# Altium project DIY-USB Led Controller.PrjPcb
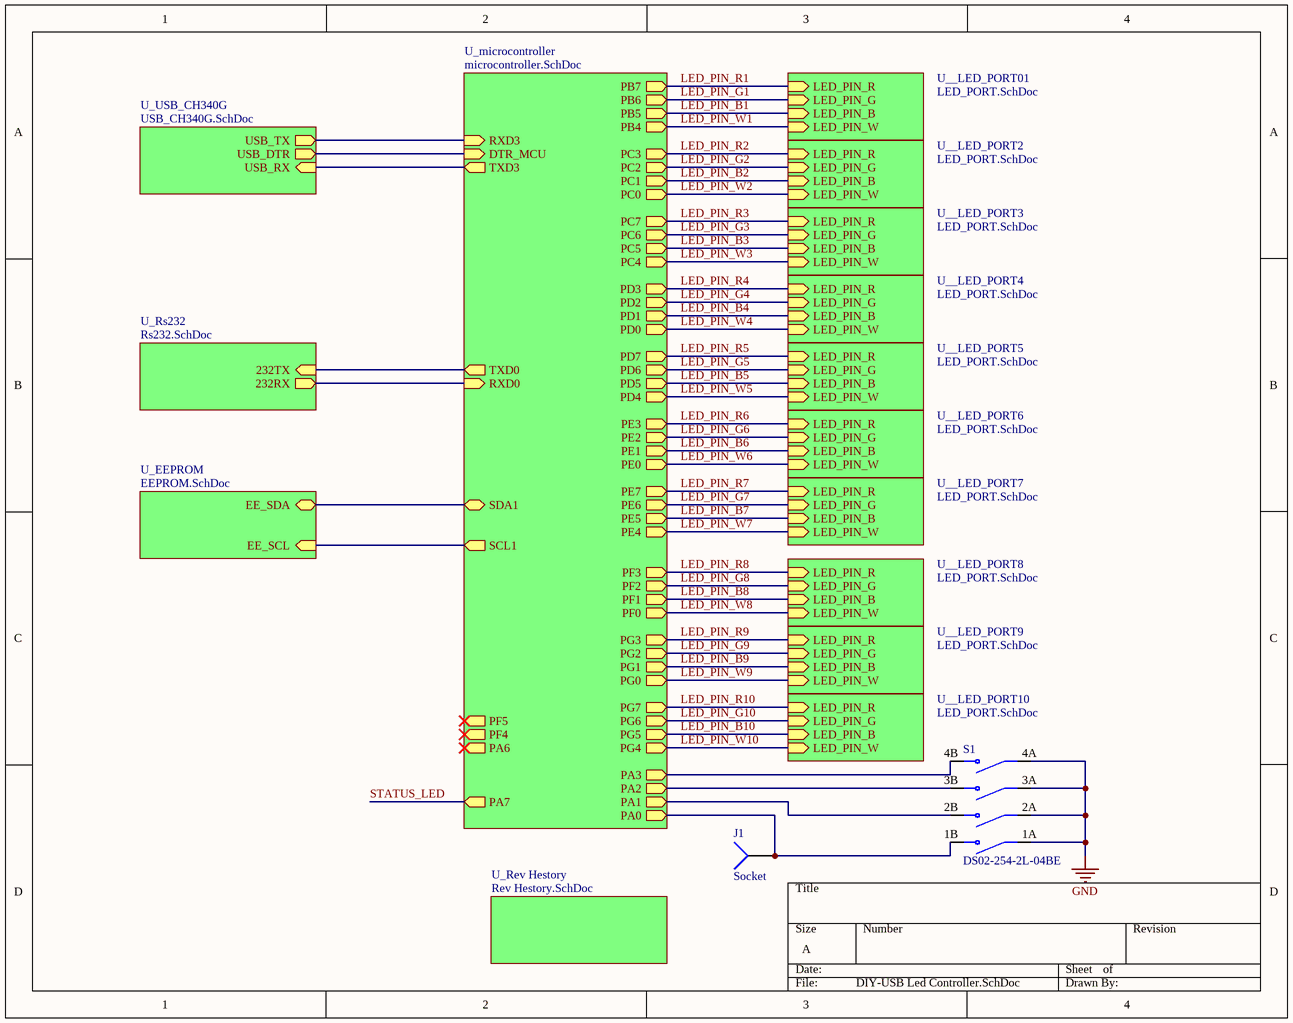
[diagram p0: DIY-USB Led Controller.SchDoc]
7 sheets, 233 parts. Net scope: hierarchical (ports join the sheet entries above them; power ports are global).
Board file: DIY-USB Led Controller.PcbDoc
Sheets:
  DIY-USB Led Controller.SchDoc
    U_EEPROM = EEPROM.SchDoc
    U_Rs232 = Rs232.SchDoc
    U_USB_CH340G = USB_CH340G.SchDoc
    U_microcontroller = microcontroller.SchDoc
    U_Rev Hestory = Rev Hestory.SchDoc
    U__LED_PORT01 = LED_PORT.SchDoc
    U__LED_PORT2 = LED_PORT.SchDoc
    U__LED_PORT3 = LED_PORT.SchDoc
    U__LED_PORT4 = LED_PORT.SchDoc
    U__LED_PORT5 = LED_PORT.SchDoc
    U__LED_PORT6 = LED_PORT.SchDoc
    U__LED_PORT7 = LED_PORT.SchDoc
    U__LED_PORT8 = LED_PORT.SchDoc
    U__LED_PORT9 = LED_PORT.SchDoc
    U__LED_PORT10 = LED_PORT.SchDoc

## Sheet DIY-USB Led Controller.SchDoc
size A; DocumentNumber: 1; SheetNumber: 1; SheetTotal: 7

### Parts
J1  Socket  [PIN1]
S1  DS02-254-2L-04BE  [SW_DS02-254-2L-04BE]

### Sub-sheets
U__LED_PORT01 = LED_PORT.SchDoc: LED_PIN_R (in), LED_PIN_B (in), LED_PIN_W (in), LED_PIN_G (in)
U__LED_PORT2 = LED_PORT.SchDoc: LED_PIN_R (in), LED_PIN_B (in), LED_PIN_W (in), LED_PIN_G (in)
U__LED_PORT3 = LED_PORT.SchDoc: LED_PIN_R (in), LED_PIN_B (in), LED_PIN_W (in), LED_PIN_G (in)
U__LED_PORT4 = LED_PORT.SchDoc: LED_PIN_R (in), LED_PIN_B (in), LED_PIN_W (in), LED_PIN_G (in)
U__LED_PORT5 = LED_PORT.SchDoc: LED_PIN_R (in), LED_PIN_B (in), LED_PIN_W (in), LED_PIN_G (in)
U__LED_PORT6 = LED_PORT.SchDoc: LED_PIN_R (in), LED_PIN_B (in), LED_PIN_W (in), LED_PIN_G (in)
U__LED_PORT7 = LED_PORT.SchDoc: LED_PIN_R (in), LED_PIN_B (in), LED_PIN_W (in), LED_PIN_G (in)
U__LED_PORT8 = LED_PORT.SchDoc: LED_PIN_R (in), LED_PIN_B (in), LED_PIN_W (in), LED_PIN_G (in)
U__LED_PORT9 = LED_PORT.SchDoc: LED_PIN_R (in), LED_PIN_B (in), LED_PIN_W (in), LED_PIN_G (in)
U__LED_PORT10 = LED_PORT.SchDoc: LED_PIN_R (in), LED_PIN_B (in), LED_PIN_W (in), LED_PIN_G (in)
U_EEPROM = EEPROM.SchDoc: EE_SCL (in), EE_SDA (bidir)
U_microcontroller = microcontroller.SchDoc: PC0 (out), PC1 (out), PC2 (out), PC3 (out), PC4 (out), PC5 (out), PC6 (out), PC7 (out), PE0 (out), PE1 (out), PE2 (out), PE3 (out), PE4 (out), PE5 (out), PE6 (out), PE7 (out), PG0 (out), PG1 (out), PG2 (out), PG3 (out), PG4 (out), PG5 (out), PG6 (out), PG7 (out), PB7 (out), PB6 (out), PB5 (out), PB4 (out), SCL1 (out), SDA1 (bidir), RXD3 (in), TXD3 (out), PD7 (out), PD6 (out), PD5 (out), PD4 (out), PD3 (out), PD2 (out), PD1 (out), PD0 (out), TXD0 (out), RXD0 (in), DTR_MCU (in), PF5 (out), PF4 (out), PF3 (out), PF2 (out), PF1 (out), PF0 (out), PA1 (out), PA3 (out), PA2 (out), PA0 (out), PA7 (out), PA6 (out)
U_Rev Hestory = Rev Hestory.SchDoc: no entries
U_Rs232 = Rs232.SchDoc: 232TX (in), 232RX (out)
U_USB_CH340G = USB_CH340G.SchDoc: USB_TX (out), USB_RX (in), USB_DTR (out)

### Nets
GND: S1.1A(COM1) S1.2A(COM2) S1.3A(COM3) S1.4A(COM4)
232RX: sheet U_Rs232/232RX, sheet U_microcontroller/RXD0
232TX: sheet U_Rs232/232TX, sheet U_microcontroller/TXD0
DTR: sheet U_USB_CH340G/USB_DTR, sheet U_microcontroller/DTR_MCU
EE_SCL: sheet U_EEPROM/EE_SCL, sheet U_microcontroller/SCL1
EE_SDA: sheet U_EEPROM/EE_SDA, sheet U_microcontroller/SDA1
LED_PIN_B1: sheet U_microcontroller/PB5, sheet U__LED_PORT01/LED_PIN_B
LED_PIN_B2: sheet U_microcontroller/PC1, sheet U__LED_PORT2/LED_PIN_B
LED_PIN_B3: sheet U_microcontroller/PC5, sheet U__LED_PORT3/LED_PIN_B
LED_PIN_B4: sheet U_microcontroller/PD1, sheet U__LED_PORT4/LED_PIN_B
LED_PIN_B5: sheet U_microcontroller/PD5, sheet U__LED_PORT5/LED_PIN_B
LED_PIN_B6: sheet U_microcontroller/PE1, sheet U__LED_PORT6/LED_PIN_B
LED_PIN_B7: sheet U_microcontroller/PE5, sheet U__LED_PORT7/LED_PIN_B
LED_PIN_B8: sheet U_microcontroller/PF1, sheet U__LED_PORT8/LED_PIN_B
LED_PIN_B9: sheet U_microcontroller/PG1, sheet U__LED_PORT9/LED_PIN_B
LED_PIN_B10: sheet U_microcontroller/PG5, sheet U__LED_PORT10/LED_PIN_B
LED_PIN_G1: sheet U_microcontroller/PB6, sheet U__LED_PORT01/LED_PIN_G
LED_PIN_G2: sheet U_microcontroller/PC2, sheet U__LED_PORT2/LED_PIN_G
LED_PIN_G3: sheet U_microcontroller/PC6, sheet U__LED_PORT3/LED_PIN_G
LED_PIN_G4: sheet U_microcontroller/PD2, sheet U__LED_PORT4/LED_PIN_G
LED_PIN_G5: sheet U_microcontroller/PD6, sheet U__LED_PORT5/LED_PIN_G
LED_PIN_G6: sheet U_microcontroller/PE2, sheet U__LED_PORT6/LED_PIN_G
LED_PIN_G7: sheet U_microcontroller/PE6, sheet U__LED_PORT7/LED_PIN_G
LED_PIN_G8: sheet U_microcontroller/PF2, sheet U__LED_PORT8/LED_PIN_G
LED_PIN_G9: sheet U_microcontroller/PG2, sheet U__LED_PORT9/LED_PIN_G
LED_PIN_G10: sheet U_microcontroller/PG6, sheet U__LED_PORT10/LED_PIN_G
LED_PIN_R1: sheet U_microcontroller/PB7, sheet U__LED_PORT01/LED_PIN_R
LED_PIN_R2: sheet U_microcontroller/PC3, sheet U__LED_PORT2/LED_PIN_R
LED_PIN_R3: sheet U_microcontroller/PC7, sheet U__LED_PORT3/LED_PIN_R
LED_PIN_R4: sheet U_microcontroller/PD3, sheet U__LED_PORT4/LED_PIN_R
LED_PIN_R5: sheet U_microcontroller/PD7, sheet U__LED_PORT5/LED_PIN_R
LED_PIN_R6: sheet U_microcontroller/PE3, sheet U__LED_PORT6/LED_PIN_R
LED_PIN_R7: sheet U_microcontroller/PE7, sheet U__LED_PORT7/LED_PIN_R
LED_PIN_R8: sheet U_microcontroller/PF3, sheet U__LED_PORT8/LED_PIN_R
LED_PIN_R9: sheet U_microcontroller/PG3, sheet U__LED_PORT9/LED_PIN_R
LED_PIN_R10: sheet U_microcontroller/PG7, sheet U__LED_PORT10/LED_PIN_R
LED_PIN_W1: sheet U_microcontroller/PB4, sheet U__LED_PORT01/LED_PIN_W
LED_PIN_W2: sheet U_microcontroller/PC0, sheet U__LED_PORT2/LED_PIN_W
LED_PIN_W3: sheet U_microcontroller/PC4, sheet U__LED_PORT3/LED_PIN_W
LED_PIN_W4: sheet U_microcontroller/PD0, sheet U__LED_PORT4/LED_PIN_W
LED_PIN_W5: sheet U_microcontroller/PD4, sheet U__LED_PORT5/LED_PIN_W
LED_PIN_W6: sheet U_microcontroller/PE0, sheet U__LED_PORT6/LED_PIN_W
LED_PIN_W7: sheet U_microcontroller/PE4, sheet U__LED_PORT7/LED_PIN_W
LED_PIN_W8: sheet U_microcontroller/PF0, sheet U__LED_PORT8/LED_PIN_W
LED_PIN_W9: sheet U_microcontroller/PG0, sheet U__LED_PORT9/LED_PIN_W
LED_PIN_W10: sheet U_microcontroller/PG4, sheet U__LED_PORT10/LED_PIN_W
RXD: sheet U_USB_CH340G/USB_RX, sheet U_microcontroller/TXD3
RXD3: sheet U_USB_CH340G/USB_TX, sheet U_microcontroller/RXD3
NetJ1_1: J1.1 S1.1B(NO1) ; sheet U_microcontroller/PA0
NetS1_2B: S1.2B(NO2) ; sheet U_microcontroller/PA1
NetS1_3B: S1.3B(NO3) ; sheet U_microcontroller/PA2
NetS1_4B: S1.4B(NO4) ; sheet U_microcontroller/PA3

### Library data of the parts
S1 = DS02-254-2L-04BE: Dip Switch SPST 4 Position Through Hole, Right Angle Piano Actuator 25mA 24VDC; Package: None; Price: None; Value: *; MP: DS02-254-2L-04BE; Availability: Unavailable
J1 = Socket: LatestRevisionDate: 17-Jul-2002; LatestRevisionNote: Re-released for DXP Platform.; Publisher: Altium Limited

## Sheet EEPROM.SchDoc
size A; DocumentNumber: 4; SheetNumber: 4; SheetTotal: 7
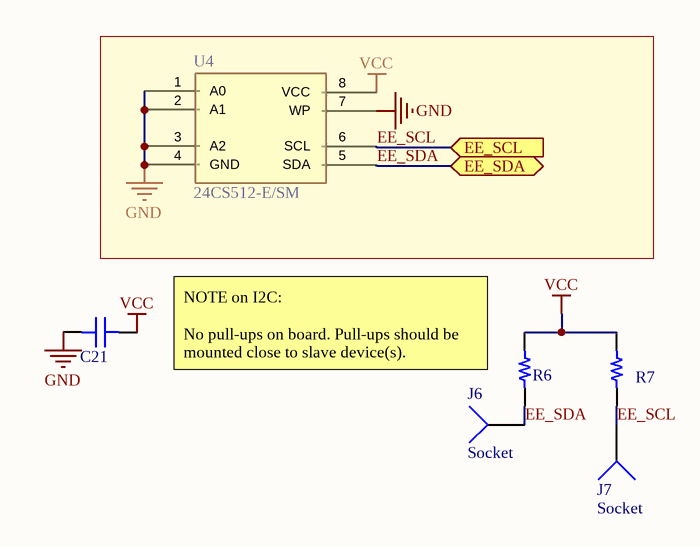
[diagram p1: EEPROM.SchDoc]

### Parts
C21  C0805C104M5RAC7025  [CAP SMD 0805]  (value not drawn)
J6  Socket  [PIN1]
J7  Socket  [PIN1]
R6  10K  [RES SMD 0805]  (value not drawn)
R7  10K  [RES SMD 0805]  (value not drawn)
U4  24CS512-E/SM  [21-0041B_8]

### Ports
EE_SCL (in), EE_SDA (bidir)

### Nets
GND: C21.1 U4.1(A0) U4.2(A1) U4.3(A2) U4.4(GND) U4.7(WP)
VCC: C21.2 R6.2 R7.2 U4.8(VCC)
EE_SCL: J7.1 R7.1 U4.6(SCL) ; port EE_SCL
EE_SDA: J6.1 R6.1 U4.5(SDA) ; port EE_SDA

### Notes on the sheet
- NOTE on I2C:
  No pull-ups on board. Pull-ups should be mounted close to slave device(s).

### Library data of the parts
C21 = CAPACITOR X7R: 0.1 µF ±20% 50V Ceramic Capacitor X7R 0805 (2012 Metric)
R6 R7 = RESISTOR: RES SMD 10K OHM 1% 1/4W 0805
U4 = AT24CW16X/24CW32X/24CW64X: EEPROM Memory IC 512Kb (64K x 8) I²C 3.4 MHz 400 ns 8-SOIJ
J6 J7 = Socket: LatestRevisionDate: 17-Jul-2002; LatestRevisionNote: Re-released for DXP Platform.; Publisher: Altium Limited

## Sheet Rs232.SchDoc
size A4; Organization: Altium Limited; Address1: L3, 12a Rodborough Rd; Address2: Frenchs Forest; Address3: NSW; Address4: Australia 2086; DocumentNumber: 2; SheetNumber: 2; SheetTotal: 7
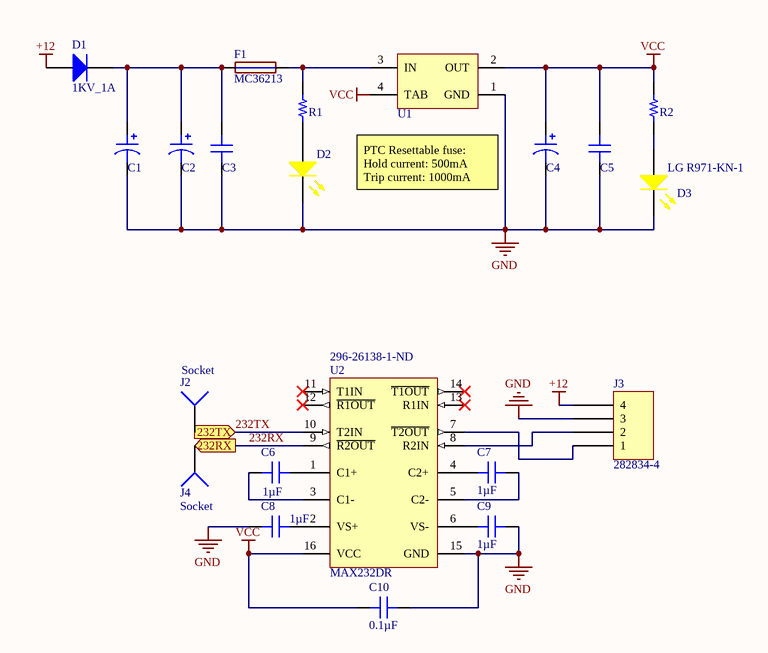
[diagram p2: Rs232.SchDoc]

### Parts
C1  UVY1C471MPD  [Cap 6.3x11 THT]  (value not drawn)
C2  UVY1C471MPD  [Cap 6.3x11 THT]  (value not drawn)
C3  C0805C475K9PAC7210  [CAP SMD 0805]  (value not drawn)
C4  UVY1C471MPD  [Cap 6.3x11 THT]  (value not drawn)
C5  C0805C475K9PAC7210  [CAP SMD 0805]  (value not drawn)
C6  value 1µF  [CAP SMD 0805]  (hidden comment: C0805C105K5RACAUTO)
C7  value 1µF  [CAP SMD 0805]  (hidden comment: C0805C105K5RACAUTO)
C8  value 1µF  [CAP SMD 0805]  (hidden comment: C0805C105K5RACAUTO)
C9  value 1µF  [CAP SMD 0805]  (hidden comment: C0805C105K5RACAUTO)
C10  value 0.1µF  [CAP SMD 0805]  (hidden comment: C0805C104M5RAC7025)
D1  1KV_1A  [Diod DO-214AC]
D2  LS R976-NR-1  [LED 0805]  (value not drawn)
D3  LG R971-KN-1  [LED 0805]
F1  value MC36213  [AP2-00002]  (hidden comment: Farnell no: 1861197)
J2  Socket  [PIN1]
J3  282834-4  [CONN. 4]
J4  Socket  [PIN1]
R1  10K  [RES SMD 0805]  (value not drawn)
R2  1K  [RES SMD 0805]  (value not drawn)
U1  LM1117IMP-5.0/NOPB  [ON SEMI SOT-223 ST(318H)]  (value not drawn)
U2  MAX232DR  Supplier Part Number 1: 296-26138-1-ND  [SOIC 16]

### Ports
232RX (out), 232TX (in)

### Nets
+12: D1.2(ANODE) J3.4
GND: C1.2 C2.2 C3.1 C4.2 C5.1 C8.1 C9.2 C10.2 D2.1(Cathode) D3.1(Cathode) J3.3 U1.1(GND) U2.15(GND)
VCC: C4.1 C5.2 C10.1 R2.2 U1.2(OUT) U1.4(TAB) U2.16(VCC)
232RX: J4.1 U2.9(~{R2OUT}) ; port 232RX
232TX: J2.1 U2.10(T2IN) ; port 232TX
NetC1_1: C1.1 C2.1 C3.2 D1.1(CATHODE) F1.1
NetC6_1: C6.1 U2.3(C1-)
NetC6_2: C6.2 U2.1(C1+)
NetC7_1: C7.1 U2.4(C2+)
NetC7_2: C7.2 U2.5(C2-)
NetC8_2: C8.2 U2.2(VS+)
NetC9_1: C9.1 U2.6(VS-)
NetD2_2: D2.2(Anode) R1.1
NetD3_2: D3.2(Anode) R2.1
NetF1_2: F1.2 R1.2 U1.3(IN)
NetJ3_1: J3.1 U2.7(~{T2OUT})
NetJ3_2: J3.2 U2.8(R2IN)

Not connected (* = marked no-connect by the designer): U2 11(T1IN)* 12(~{R1OUT})* 13(R1IN)* 14(~{T1OUT})*

### Notes on the sheet
- PTC Resettable fuse:
  Hold current: 500mA
  Trip current: 1000mA
- Title
- Size:
- Date:
- A4
- Number:
- Time:
- Revision:
- Sheet
- of
- File:

### Library data of the parts
C1 C2 C4 = POLARIZED CAP: CAP ALUM 470UF 20% 16V RADIAL
C3 C5 = CAPACITOR X7R: 4.7 µF ±10% 6.3V Ceramic Capacitor X5R 0805 (2012 Metric)
C6-C9 = 12065C105JAT2A: 1 µF ±10% 50V Ceramic Capacitor X7R 0805 (2012 Metric); Manufacturer: AVX Corporation; Tolerance: ±5%; Part Number: 12065C105JAT2A; Applications: General Purpose; Capacitance: 1µF; ComponentLink1Description: Datasheet; ComponentLink1URL: http://datasheets.avx.com/X7RDielectric.pdf; ComponentLink2Description: DigiKey Link; ComponentLink2URL: http://digikey.com/product-detail/en/avx-corporation/12065C105JAT2A/478-10884-1-ND/7536453; Device Package: 1206 (3216 Metric); LastUpdated: 1/21/2020 12:03:49 AM; Lifecycle Status: Active; Minimum Order: 1; Mounting Type: Surface Mount, MLCC; Operating Temperature: -55°C ~ 125°C; Package / Case: 1206 (3216 Metric); Packaging: TapeAndReel; PartId: 19654; Part Status: Active; Price: 0.15; Series: -; Size / Dimension: 0.126" L x 0.063" W (3.20mm x 1.60mm); Supplier 1: DigiKey; Supplier Part Number 1: 478-10884-1-ND; Temperature Coefficient: X7R; Thickness (Max): 0.070" (1.78mm); Voltage - Rated: 50V
C10 = C1206C104K5RAC7025: 0.1 µF ±20% 50V Ceramic Capacitor X7R 0805 (2012 Metric); Manufacturer: KEMET; Tolerance: ±10%; Part Number: C1206C104K5RAC7025; Applications: Bypass, Decoupling; Capacitance: 0.1µF; ComponentLink1Description: Datasheet; ComponentLink1URL: https://api.kemet.com/component-edge/download/datasheet/C1206C104K5RAC7025.pdf; ComponentLink2Description: DigiKey Link; ComponentLink2URL: http://digikey.com/product-detail/en/kemet/C1206C104K5RAC7025/399-7356-1-ND/5322076; Device Package: 1206 (3216 Metric); LastUpdated: 1/21/2020 12:03:23 AM; Lifecycle Status: Active; Minimum Order: 1; Mounting Type: Surface Mount, MLCC; Operating Temperature: -55°C ~ 125°C; Package / Case: 1206 (3216 Metric); Packaging: TapeAndReel; PartId: 18895; Part Status: Active; Price: 0.02; Series: SMD Comm X7R; Size / Dimension: 0.126" L x 0.063" W (3.20mm x 1.60mm); Supplier 1: DigiKey; Supplier Part Number 1: 399-7356-1-ND; Temperature Coefficient: X7R; Thickness (Max): 0.035" (0.88mm); Voltage - Rated: 50V
D1 = Diod DO-214AC: DIODE GEN PURP 1KV 1A SMA  S1M; Published: 8-Jun-2000; LatestRevisionDate: 17-Jul-2002; LatestRevisionNote: Re-released for DXP Platform.; PackageVersion: Sep-1996; PackageReference: SMC; Publisher: Altium Limited; PackageDescription: DO-214-AB/SMC; 2 C-Bend Leads; Body 7.9 x 5.9 mm, inc. leads (LxW); Code_JEDEC: DO-214-AB
D2 = SMD LED INDICATORS: LED RED DIFFUSED 0805 SMD
D3 = SMD LED INDICATORS: LED GREEN DIFFUSED 0805 SMD
F1 = FUSE: Resetable PTC fuse, Ih = 0.5A, It = 1.0A, 0805 package; PartGroup: Resistors,Resettable fuses,SMD; Manufacturer: Multicomp; AN: A02-0622; TemperatureRange: -40°C to + 85°C; Height: 1,25; MPN: MC36213
J3 = 282834-4: TERM BLOCK HDR 4POS 90DEG 5.08MM; Manufacturer: TE Connectivity AMP Connectors; Current: 10A; Mating Orientation: Horizontal with Board; Number of Levels: 1; Pitch: 0.100" (2.54mm); Positions Per Level: 4; Voltage: 150V; Wire Gauge: 16-30 AWG; Wire Termination: Screw - Rising Cage Clamp; Part Number: 282834-4; Color: Green; ComponentLink1Description: Datasheet; ComponentLink1URL: https://www.te.com/commerce/DocumentDelivery/DDEController?Action=srchrtrv&DocNm=282834&DocType=Customer+Drawing&DocLang=English; ComponentLink2Description: DigiKey Link; ComponentLink2URL: http://digikey.com/product-detail/en/te-connectivity-amp-connectors/282834-4/A98335-ND/1153265; LastUpdated: 1/15/2020 4:16:05 AM; Lifecycle Status: Active; Minimum Order: 1; Mounting Type: Through Hole; Packaging: Bulk; Part Status: Active; Price: 2.68; Series: Buchanan; Supplier 1: DigiKey; Supplier Part Number 1: A98335-ND
R1 = RESISTOR: RES SMD 10K OHM 1% 1/4W 0805
R2 = RESISTOR: RES SMD 1K OHM 1% 1/4W 0805
U1 = LM1117IMP-5.0/NOPB: 800mA Low-Dropout Linear Regulator, 4-pin SOT-223, Pb-Free; Manufacturer: National Semiconductor; PackageTopMarking: XYTT*N06B; PowerWise: N; CompType: LDO IC; High-Reliability: Y; DatasheetVersion: Apr-2006; PackageVersion: revB, Apr-2003; PackageReference: MP04A; PackageDescription: Molded SOT-223, 6.50 x 3.56 x 1.6mm Body, 4 Lead, 2.3mm Pitch; PartNumber: LM1117IMP-5.0/NOPB; RoHS: Y; PinCount: 4; Code_JEDEC: TO-261-AA; Code_IPC: SOT223-4; ComponentLink1Description: Manufacturer URL; ComponentLink1URL: http://www.national.com/; ComponentLink2Description: LM1117 Datasheet; ComponentLink2URL: http://www.national.com/ds/LM/LM1117.pdf; ComponentLink3Description: LM1117 Web Page; ComponentLink3URL: http://www.national.com/pf/LM/LM1117.html; ComponentLink4Description: MP04A Package Page; ComponentLink4URL: http://www.national.com/packaging/folders/mp04a.html
U2 = MAX232DR: IC TRANSCEIVER FULL 2/2 16SOIC; Manufacturer 1: Texas Instruments; Manufacturer Part Number 1: MAX232ECDR; SubFamily: RS-232; Drivers Per Package: 2; Supply Voltage(s)(V): 5; ESD HBM(kV): +/-2; ICC(Max)(mA): 10; Single Supply: TRUE; Nominal Supply Current: 10mA; Data Rate: 120Kbps; Operating Supply Voltage: 5V; Min Supply Voltage: 4.5V; Max Supply Voltage: 5.5V; Logic Function: Transceiver,Receiver; Number of Transceivers: 1; Number of I/Os: 8; Propagation Delay: 0.5us; Simplex/Duplex: Full Duplex; DatasheetVersion: SLLS047L; PackageVersion: revM, Jun-2011; PackageReference: D16; PackageDescription: 16-Pin Plastic Small Outline Integrated Circuit, 9.9 x 3.9 mm, Pitch 1.27 mm Pitch; Receivers Per Package: 2; RS-232: TRUE; ComponentLink1Description: Manufacturer URL; ComponentLink1URL: www.ti.com; ComponentLink2Description: Datasheet; ComponentLink2URL: http://www.ti.com/general/docs/lit/getliterature.tsp?genericPartNumber=MAX232&fileType=pdf; ComponentLink3Description: Package Specification; ComponentLink3URL: http://www.ti.com/litv/pdf/mpds178g; Supplier 1: Digi-Key; Stock 1: 2544; Pricing 1: 1=1.09000, 10=0.97600, 25=0.92680, 100=0.71170, 250=0.62892, 500=0.59580, 1000=0.46340 (USD); RoHS: Yes; Mount: Surface Mount; Case/Package: D; Number of Pins: 16; Min Operating Temperature: -40°C; Max Operating Temperature: 85°C; Packaging: Tape and Reel; Number of Drivers: 2; Package Quantity: 1; Number of Receivers: 2; Number of Transmitters: 2; Radiation Hardening: No; REACH SVHC: No SVHC; Lead Free: Lead Free; ComponentLink4URL: https://datasheet.ciiva.com/4783/slls723b-121575-4783681.pdf?src-supplier=Mouser; ComponentLink4Description: https://datasheet.ciiva.com/4783/slls723b-121575-4783681.pdf?src-supplier=Mouser; ComponentLink5URL: https://datasheet.ciiva.com/41461/001187142-da-01-en-ic-dual-rs232-esd-max232ecdr-soic-16-tid-41461900.pdf?src-supplier=Conrad; ComponentLink5Description: https://datasheet.ciiva.com/41461/001187142-da-01-en-ic-dual-rs232-esd-max232ecdr-soic-16-tid-41461900.pdf?src-supplier=Conrad; ComponentLink6URL: https://datasheet.ciiva.com/1701/max232e-1701542.pdf?src-supplier=Digi-Key; ComponentLink6Description: https://datasheet.ciiva.com/1701/max232e-1701542.pdf?src-supplier=Digi-Key; ComponentLink7URL: https://datasheet.ciiva.com/14427/slls723b-14427158.pdf?src-supplier=Avnet; ComponentLink7Description: https://datasheet.ciiva.com/14427/slls723b-14427158.pdf?src-supplier=Avnet; ComponentLink8URL: https://datasheet.ciiva.com/1701/max232e-1701543.pdf?src-supplier=Digi-Key; ComponentLink8Description: https://datasheet.ciiva.com/1701/max232e-1701543.pdf?src-supplier=Digi-Key; ComponentLink9URL: https://datasheet.ciiva.com/1701/max232e-1701544.pdf?src-supplier=Digi-Key; ComponentLink9Description: https://datasheet.ciiva.com/1701/max232e-1701544.pdf?src-supplier=Digi-Key; ComponentLink10URL: https://datasheet.ciiva.com/46397/1864431-46397208.pdf?src-supplier=Element14; ComponentLink10Description: https://datasheet.ciiva.com/46397/1864431-46397208.pdf?src-supplier=Element14; ComponentLink11URL: https://datasheet.ciiva.com/15224/getdatasheetpartid-82083-15224955.pdf?src-supplier=Verical; ComponentLink11Description: https://datasheet.ciiva.com/15224/getdatasheetpartid-82083-15224955.pdf?src-supplier=Verical
J2 J4 = Socket: LatestRevisionDate: 17-Jul-2002; LatestRevisionNote: Re-released for DXP Platform.; Publisher: Altium Limited

## Sheet USB_CH340G.SchDoc
size A; DocumentNumber: 5; SheetNumber: 5; SheetTotal: 7
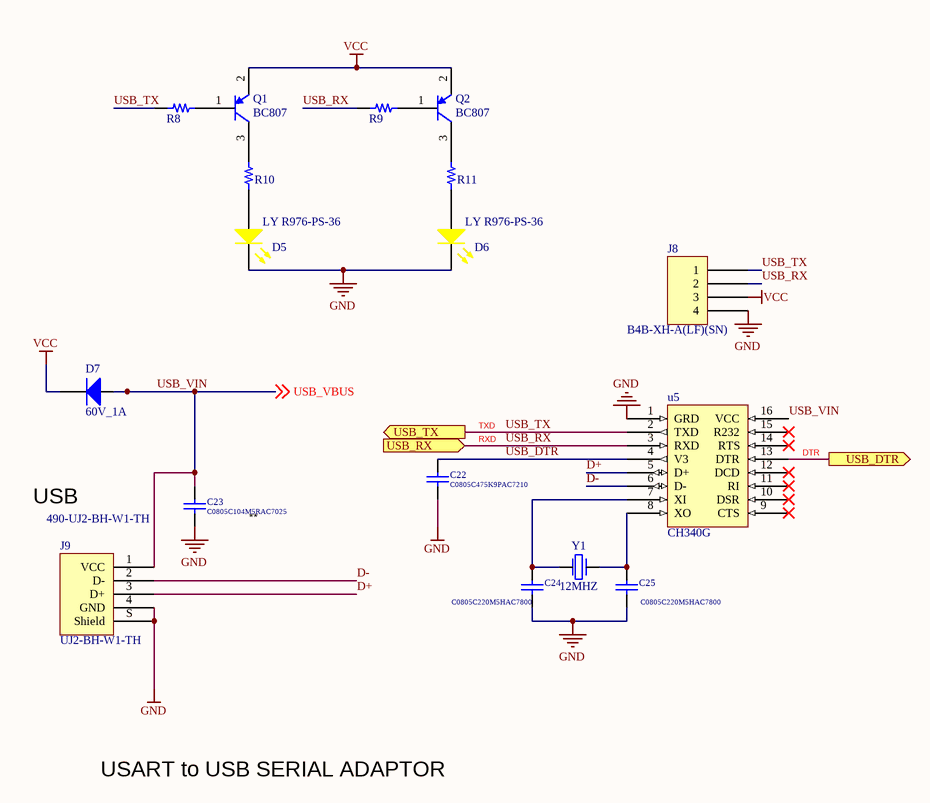
[diagram p3: USB_CH340G.SchDoc]

### Parts
C22  C0805C475K9PAC7210  [CAP SMD 0805]
C23  C0805C104M5RAC7025  [CAP SMD 0805]
C24  C0805C220M5HAC7800  [CAP SMD 0805]
C25  C0805C220M5HAC7800  [CAP SMD 0805]
D5  LY R976-PS-36  [LED 0805]
D6  LY R976-PS-36  [LED 0805]
D7  60V_1A  [SOD-123-]
J8  B4B-XH-A(LF)(SN)  [XH-Conn 1*4 straight]
J9  UJ2-BH-W1-TH  Supplier Part Number 1: 490-UJ2-BH-W1-TH  [FCI USB 61729-1011BLF]
Q1  BC807  [SOT-23]
Q2  BC807  [SOT-23]
R8  1K  [RES SMD 0805]  (value not drawn)
R9  1K  [RES SMD 0805]  (value not drawn)
R10  1K  [RES SMD 0805]  (value not drawn)
R11  1K  [RES SMD 0805]  (value not drawn)
u5  CH340G  [16-SOIC]
Y1  12MHZ  [AP7-00085]

### Ports
USB_DTR (out), USB_RX (in), USB_TX (out)

### Nets
GND: C22.1 C23.1 C24.1 C25.1 D5.1(Cathode) D6.1(Cathode) J8.4 J9.4(GND) J9.S(Shield) u5.1(GRD)
VCC: D7.1(CATHODE) J8.3 Q1.2(E) Q2.2(E)
D+: J9.3(D+) u5.5(D+)
D-: J9.2(D-) u5.6(D-)
DTR: u5.13(DTR) ; port USB_DTR
RXD: J8.2 R9.1 u5.3(RXD) ; port USB_RX  [also labelled USB_RX]
TXD: J8.1 R8.1 u5.2(TXD) ; port USB_TX  [also labelled USB_TX]  [project net RXD3]
USB_DTR: C22.2 u5.4(V3)
USB_VIN: C23.2 D7.2(ANODE) J9.1(VCC) u5.16(VCC) ; off-sheet USB_VBUS  [also labelled USB_VBUS]
NetC24_2: C24.2 u5.7(XI) Y1.1
NetC25_2: C25.2 u5.8(XO) Y1.2
NetD5_2: D5.2(Anode) R10.1
NetD6_2: D6.2(Anode) R11.1
NetQ1_1: Q1.1(B) R8.2
NetQ1_3: Q1.3(C) R10.2
NetQ2_1: Q2.1(B) R9.2
NetQ2_3: Q2.3(C) R11.2

Not connected (* = marked no-connect by the designer): u5 9(CTS)* 10(DSR)* 11(RI)* 12(DCD)* 14(RTS)* 15(R232)*

### Notes on the sheet
- USB
- **
- USART to USB SERIAL ADAPTOR

### Library data of the parts
C22 = Cap_3: 4.7 µF ±10% 6.3V Ceramic Capacitor X5R 0805 (2012 Metric); Value: 0.1uF; Published: 8-Jun-2000; LatestRevisionDate: 17-Jul-2002; LatestRevisionNote: Re-released for DXP Platform.; PackageReference: RAD-0.3; Publisher: Altium Limited; PackageDescription: Radial Cap, Thru-Hole; 2 Leads; 0.3 in Pin Spacing
C23 = Cap_3: 0.1 µF ±20% 50V Ceramic Capacitor X7R 0805 (2012 Metric); Value: 0.1uF; Published: 8-Jun-2000; LatestRevisionDate: 17-Jul-2002; LatestRevisionNote: Re-released for DXP Platform.; PackageReference: RAD-0.3; Publisher: Altium Limited; PackageDescription: Radial Cap, Thru-Hole; 2 Leads; 0.3 in Pin Spacing
C24 C25 = Cap_3: 22 pF ±20% 50V Ceramic Capacitor X8R 0805 (2012 Metric); Value: 0.1uF; Published: 8-Jun-2000; LatestRevisionDate: 17-Jul-2002; LatestRevisionNote: Re-released for DXP Platform.; PackageReference: RAD-0.3; Publisher: Altium Limited; PackageDescription: Radial Cap, Thru-Hole; 2 Leads; 0.3 in Pin Spacing
D5 D6 = SMD LED INDICATORS: LED YELLOW DIFFUSED 0805 SMD
D7 = Diod_1: DIODE SCHOTTKY 60V 1A SOD123; Published: 8-Jun-2000; LatestRevisionDate: 17-Jul-2002; LatestRevisionNote: Re-released for DXP Platform.; PackageVersion: Sep-1996; PackageReference: SMC; Publisher: Altium Limited; PackageDescription: DO-214-AB/SMC; 2 C-Bend Leads; Body 7.9 x 5.9 mm, inc. leads (LxW); Code_JEDEC: DO-214-AB
J8 = B4B-XH-A(LF)(SN): CONN HEADER VERT 4POS 2.5MM; Manufacturer: JST Sales America Inc.; Contact Length - Post: 0.134" (3.40mm); Current Rating (Amps): 3A; Material Flammability Rating: UL94 V-0; Number of Positions: 4; Number of Positions Loaded: All; Pitch - Mating: 0.098" (2.50mm); Shrouding: Shrouded - 4 Wall; Style: Board to Cable/Wire; Voltage Rating: 250V; Part Number: B4B-XH-A(LF)(SN); ComponentLink1Description: Datasheet; ComponentLink1URL: http://www.jst-mfg.com/product/pdf/eng/eXH.pdf; ComponentLink2Description: DigiKey Link; ComponentLink2URL: http://digikey.com/product-detail/en/jst-sales-america-inc/B4B-XH-A-LF-SN/455-2249-ND/1651047; Connector Type: Header; Contact Finish - Mating: Tin; Contact Finish - Post: Tin; Contact Material: Brass; Contact Shape: Square; Contact Type: Male Pin; Fastening Type: Detent Lock; Insulation Color: Natural; Insulation Height: 0.276" (7.00mm); Insulation Material: Polyamide (PA66), Nylon 6/6; LastUpdated: 1/12/2020 11:46:34 PM; Lifecycle Status: Active; Minimum Order: 1; Mounting Type: Through Hole; Number of Rows: 1; Operating Temperature: -25°C ~ 85°C; Packaging: Bulk; PartId: 69; Part Status: Active; Price: 0.21; Series: XH; Supplier 1: DigiKey; Supplier Part Number 1: 455-2249-ND; Termination: Press-Fit, Solder
J9 = USB 2.0 Type B: USB-B (USB TYPE-B) USB 2.0 Receptacle Connector 4 Position Through Hole, Right Angle; Supplier 1: Mouser
Q1 Q2 = PNP Transistor: TRANS PNP 45V 0.5A SOT-23; Published: 8-Jun-2000; LatestRevisionDate: 29-May-2009; LatestRevisionNote: IPC-7351 Footprint Added.; PackageVersion: Aug-1999; PackageReference: SOT-23B; Publisher: Altium Limited; PackageDescription: 3-Pin SOT-23 Package 0.95 mm Pitch, 2.4 mm Lead Span
R8-R11 = RESISTOR: RES SMD 1K OHM 1% 1/4W 0805
u5 = CH340G: CH340G USB TO SERIAL (TTL) IC
Y1 = CRYSTAL: 12 MHz ±30ppm Crystal 20pF 50 Ohms HC-49/US; PartGroup: Frequency devices,Crystals,THM; Manufacturer: TXC Corporation; MPN: 9B08100001-A1; AN: A07-0123; Value: 8.192MHz; ComponentStatus: 'New (not verified)'; Status: Active; Verified by: Sveinung Helgeland; Verified date: 2006-02-17; Height: 3.29999995231628; FootprintStatus: 'New (Not verified)'

## Sheet microcontroller.SchDoc
size A; DocumentNumber: 3; SheetNumber: 3; SheetTotal: 7
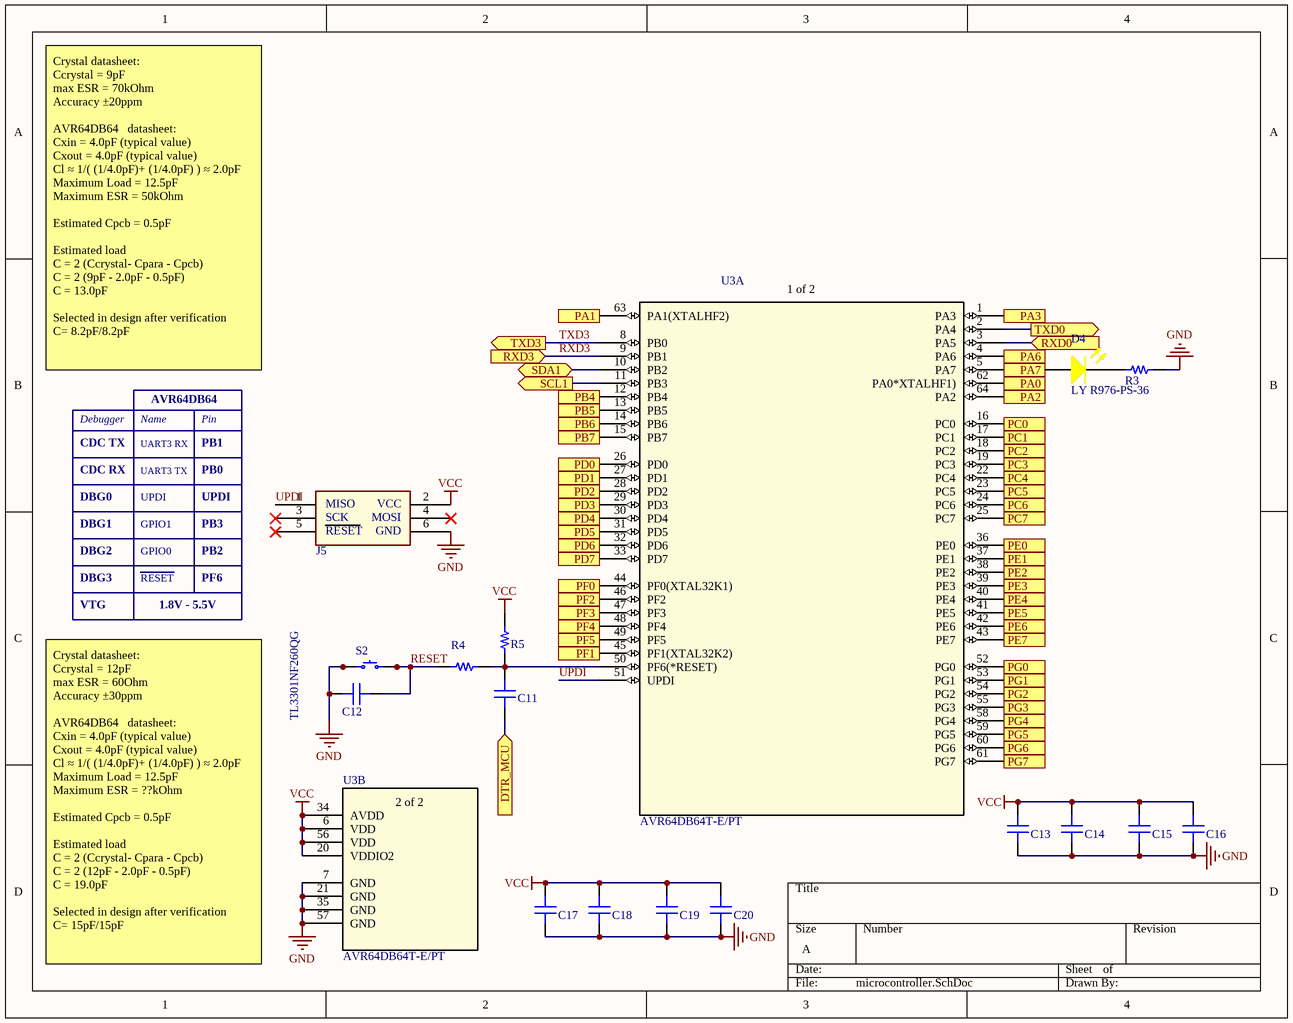
[diagram p4: microcontroller.SchDoc]

### Parts
C11  C0805C104M5RAC7025  [CAP SMD 0805]  (value not drawn)
C12  C0805C104M5RAC7025  [CAP SMD 0805]  (value not drawn)
C13  C0805C104M5RAC7025  [CAP SMD 0805]  (value not drawn)
C14  C0805C104M5RAC7025  [CAP SMD 0805]  (value not drawn)
C15  C0805C104M5RAC7025  [CAP SMD 0805]  (value not drawn)
C16  C0805C104M5RAC7025  [CAP SMD 0805]  (value not drawn)
C17  C0805C475K9PAC7210  [CAP SMD 0805]  (value not drawn)
C18  C0805C475K9PAC7210  [CAP SMD 0805]  (value not drawn)
C19  C0805C475K9PAC7210  [CAP SMD 0805]  (value not drawn)
C20  C0805C475K9PAC7210  [CAP SMD 0805]  (value not drawn)
D4  LY R976-PS-36  [LED 0805]
J5  HEADER 2x3  [2*3PIN_HEAD_2.54]  (value not drawn)
R3  1K  [RES SMD 0805]  (value not drawn)
R4  330R  [RES SMD 0805]  (value not drawn)
R5  10K  [RES SMD 0805]  (value not drawn)
S2  TL3301NF260QG  [Tactile Switche]
U3  AVR64DB64T-E/PT  [64-LQFP]  (parts A,B of 2)

### Ports
DTR_MCU (in), PA0 (out), PA1 (out), PA2 (out), PA3 (out), PA6 (out), PA7 (out), PB4 (out), PB5 (out), PB6 (out), PB7 (out), PC0 (out), PC1 (out), PC2 (out), PC3 (out), PC4 (out), PC5 (out), PC6 (out), PC7 (out), PD0 (out), PD1 (out), PD2 (out), PD3 (out), PD4 (out), PD5 (out), PD6 (out), PD7 (out), PE0 (out), PE1 (out), PE2 (out), PE3 (out), PE4 (out), PE5 (out), PE6 (out), PE7 (out), PF0 (out), PF1 (out), PF2 (out), PF3 (out), PF4 (out), PF5 (out), PG0 (out), PG1 (out), PG2 (out), PG3 (out), PG4 (out), PG5 (out), PG6 (out), PG7 (out), RXD0 (in), RXD3 (in), SCL1 (out), SDA1 (bidir), TXD0 (out), TXD3 (out)

### Nets
GND: C12.1 C13.1 C14.1 C15.1 C16.1 C17.1 C18.1 C19.1 C20.1 J5.6 R3.2 S2.1 S2.2 U3.7(GND) U3.21(GND) U3.35(GND) U3.57(GND)
VCC: C13.2 C14.2 C15.2 C16.2 C17.2 C18.2 C19.2 C20.2 J5.2 R5.2 U3.6(VDD) U3.20(VDDIO2) U3.34(AVDD) U3.56(VDD)
232RX: U3.3(PA5) ; port RXD0
232TX: U3.2(PA4) ; port TXD0
DTR: C11.1 ; port DTR_MCU
EE_SCL: U3.11(PB3) ; port SCL1
EE_SDA: U3.10(PB2) ; port SDA1
LED_PIN_B1: U3.13(PB5) ; port PB5
LED_PIN_B2: U3.17(PC1) ; port PC1
LED_PIN_B3: U3.23(PC5) ; port PC5
LED_PIN_B4: U3.27(PD1) ; port PD1
LED_PIN_B5: U3.31(PD5) ; port PD5
LED_PIN_B6: U3.37(PE1) ; port PE1
LED_PIN_B7: U3.41(PE5) ; port PE5
LED_PIN_B8: U3.45(PF1(XTAL32K2)) ; port PF1
LED_PIN_B9: U3.53(PG1) ; port PG1
LED_PIN_B10: U3.59(PG5) ; port PG5
LED_PIN_G1: U3.14(PB6) ; port PB6
LED_PIN_G2: U3.18(PC2) ; port PC2
LED_PIN_G3: U3.24(PC6) ; port PC6
LED_PIN_G4: U3.28(PD2) ; port PD2
LED_PIN_G5: U3.32(PD6) ; port PD6
LED_PIN_G6: U3.38(PE2) ; port PE2
LED_PIN_G7: U3.42(PE6) ; port PE6
LED_PIN_G8: U3.46(PF2) ; port PF2
LED_PIN_G9: U3.54(PG2) ; port PG2
LED_PIN_G10: U3.60(PG6) ; port PG6
LED_PIN_R1: U3.15(PB7) ; port PB7
LED_PIN_R2: U3.19(PC3) ; port PC3
LED_PIN_R3: U3.25(PC7) ; port PC7
LED_PIN_R4: U3.29(PD3) ; port PD3
LED_PIN_R5: U3.33(PD7) ; port PD7
LED_PIN_R6: U3.39(PE3) ; port PE3
LED_PIN_R7: U3.43(PE7) ; port PE7
LED_PIN_R8: U3.47(PF3) ; port PF3
LED_PIN_R9: U3.55(PG3) ; port PG3
LED_PIN_R10: U3.61(PG7) ; port PG7
LED_PIN_W1: U3.12(PB4) ; port PB4
LED_PIN_W2: U3.16(PC0) ; port PC0
LED_PIN_W3: U3.22(PC4) ; port PC4
LED_PIN_W4: U3.26(PD0) ; port PD0
LED_PIN_W5: U3.30(PD4) ; port PD4
LED_PIN_W6: U3.36(PE0) ; port PE0
LED_PIN_W7: U3.40(PE4) ; port PE4
LED_PIN_W8: U3.44(PF0(XTAL32K1)) ; port PF0
LED_PIN_W9: U3.52(PG0) ; port PG0
LED_PIN_W10: U3.58(PG4) ; port PG4
RESET: C12.2 R4.2 S2.3 S2.4
RXD3: U3.9(PB1) ; port RXD3
STATUS_LED: D4.2(Anode) U3.5(PA7) ; port PA7
TXD3: U3.8(PB0) ; port TXD3  [project net RXD]
UPDI: J5.1 U3.51(UPDI)
NetC11_2: C11.2 R4.1 R5.1 U3.50(PF6(*RESET))
NetD4_1: D4.1(Cathode) R3.1
NetJ1_1: U3.62(PA0*XTALHF1)) ; port PA0
NetS1_2B: U3.63(PA1(XTALHF2)) ; port PA1
NetS1_3B: U3.64(PA2) ; port PA2
NetS1_4B: U3.1(PA3) ; port PA3
NetU3_4: U3.4(PA6) ; port PA6
NetU3_48: U3.48(PF4) ; port PF4
NetU3_49: U3.49(PF5) ; port PF5

Not connected (* = marked no-connect by the designer): J5 3* 4* 5*

### Notes on the sheet
- Crystal datasheet:
  Ccrystal = 9pF
  max ESR = 70kOhm
  Accuracy ±20ppm
  AVR64DB64   datasheet:
  Cxin = 4.0pF (typical value)
  Cxout = 4.0pF (typical value)
  Cl ≈ 1/( (1/4.0pF)+ (1/4.0pF) ) ≈ 2.0pF
  Maximum Load = 12.5pF
  Maximum ESR = 50kOhm
  Estimated Cpcb = 0.5pF
  Estimated load
  C = 2 (Ccrystal- Cpara - Cpcb)
  C = 2 (9pF - 2.0pF - 0.5pF)
  C = 13.0pF
  Selected in design after verification
  C= 8.2pF/8.2pF
- Debugger
- Name
- AVR64DB64
- Pin
- DBG0
- CDC TX
- CDC RX
- UPDI
- UART3 RX
- UART3 TX
- PB0
- PB1
- DBG1
- DBG2
- GPIO1
- GPIO0
- PB3
- PB2
- DBG3
- VTG
- RESET
- 1.8V - 5.5V
- PF6
- Crystal datasheet:
  Ccrystal = 12pF
  max ESR = 60Ohm
  Accuracy ±30ppm
  AVR64DB64   datasheet:
  Cxin = 4.0pF (typical value)
  Cxout = 4.0pF (typical value)
  Cl ≈ 1/( (1/4.0pF)+ (1/4.0pF) ) ≈ 2.0pF
  Maximum Load = 12.5pF
  Maximum ESR = ??kOhm
  Estimated Cpcb = 0.5pF
  Estimated load
  C = 2 (Ccrystal- Cpara - Cpcb)
  C = 2 (12pF - 2.0pF - 0.5pF)
  C = 19.0pF
  Selected in design after verification
  C= 15pF/15pF
- (in symbol AVR64DB64T-E/PT, part A) 1 of 2
- (in symbol AVR64DB64T-E/PT, part B) 2 of 2
- (in symbol HEADER 2x3) MISO; VCC; SCK; MOSI; RESET; GND

### Library data of the parts
C11-C16 = CAPACITOR X7R: as C21 on sheet EEPROM
C17-C20 = CAPACITOR X7R: as C3 on sheet Rs232
D4 = SMD LED INDICATORS_2: LED YELLOW DIFFUSED 0805 SMD
J5 = HEADER 2x3: 2x3 pin header, 2.54 mm pitch, THM; PartGroup: Mechanical devices,Connectors,Pin headers; Manufacturer: SAMTEC; AN: A08-0538; Value: MTSW-103-08-L-D-276; TemperatureRange: max. 125 degrees; Height: 9,60000038146973; MPN: MTSW-103-08-L-D-276
R3 = RESISTOR_2: RES SMD 1K OHM 1% 1/4W 0805
R4 = RESISTOR: RES SMD 330 OHM 1% 1/4W 0805
R5 = RESISTOR: RES SMD 10K OHM 1% 1/4W 0805
S2 = 1571563-4: SWITCH TACTILE SPST-NO 0.05A 12V; Manufacturer: TE Connectivity ALCOSWITCH Switches; Actuator Height off PCB, Vertical: 5.00mm; Actuator Orientation: Top Actuated; Actuator Type: Standard; Contact Rating @ Voltage: 0.05A @ 24VDC; Illumination: Non-Illuminated; Operating Force: 260gf; Outline: 6.00mm x 6.00mm; Switch Function: Off-Mom; Part Number: 1571563-4; Circuit: SPST-NO; ComponentLink1Description: Datasheet; ComponentLink1URL: https://www.te.com/commerce/DocumentDelivery/DDEController?Action=srchrtrv&DocNm=1308111-1_SWITCHES_CORE_PROGRAM_CATALOG&DocType=CS&DocLang=English; ComponentLink2Description: DigiKey Link; ComponentLink2URL: http://digikey.com/product-detail/en/te-connectivity-alcoswitch-switches/1571563-4/450-2055-1-ND/4569745; LastUpdated: 2/4/2020 2:40:00 PM; Lifecycle Status: Active; Minimum Order: 1; Mounting Type: Surface Mount; Operating Temperature: -35°C ~ 85°C; Packaging: TapeAndReel; Part Status: Active; Price: 0.16; Series: FSMJSMA; Supplier 1: DigiKey; Supplier Part Number 1: 450-2055-1-ND; Termination Style: Gull Wing
U3 = AVR64DB64T-E/PT: AVR series Microcontroller IC 8-Bit 24MHz 64KB (64K x 8) FLASH 64-TQFP (10x10); Mfr_Name: Microchip; Copyright: Copyright (C) 2022 Ultra Librarian. All rights reserved.; Manufacturer_Part_Number: AVR64DB64T-E/PT; RefDes: RefDes; Type: DEV

## Sheet Rev Hestory.SchDoc
size A; DocumentNumber: 7; SheetNumber: 7; SheetTotal: 7
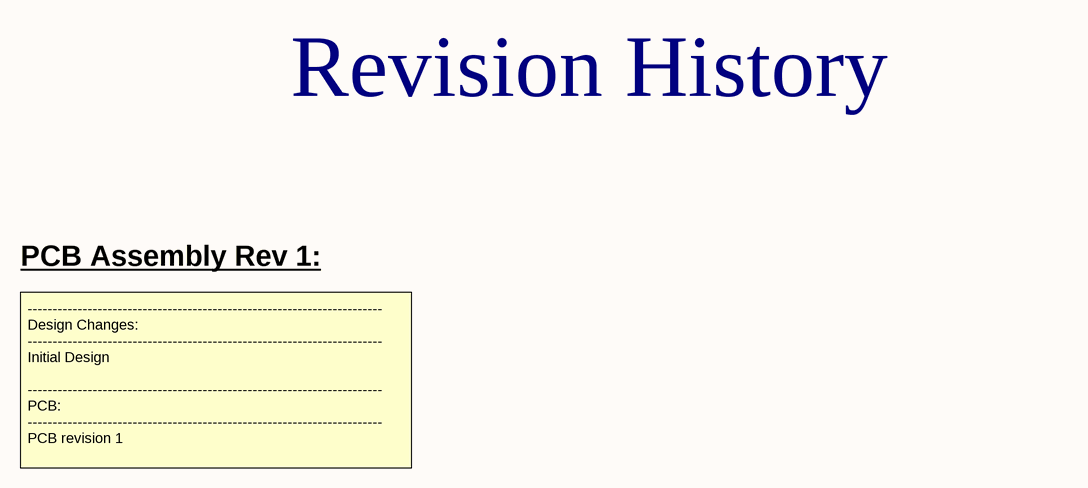
[diagram p5: Rev Hestory.SchDoc]

### Notes on the sheet
- Revision History
- PCB Assembly Rev 1:
- -----------------------------------------------------------------------
  Design Changes:
  -----------------------------------------------------------------------
  Initial Design
  -----------------------------------------------------------------------
  PCB:
  -----------------------------------------------------------------------
  PCB revision 1

## Sheet LED_PORT.SchDoc
size A; DocumentNumber: 6; SheetNumber: 6; SheetTotal: 7
Used 10 times, as channels U__LED_PORT01, U__LED_PORT2, U__LED_PORT3, U__LED_PORT4, U__LED_PORT5, U__LED_PORT6, U__LED_PORT7, U__LED_PORT8, U__LED_PORT9, U__LED_PORT10. Parts and nets are listed once, with the designators drawn on the sheet.
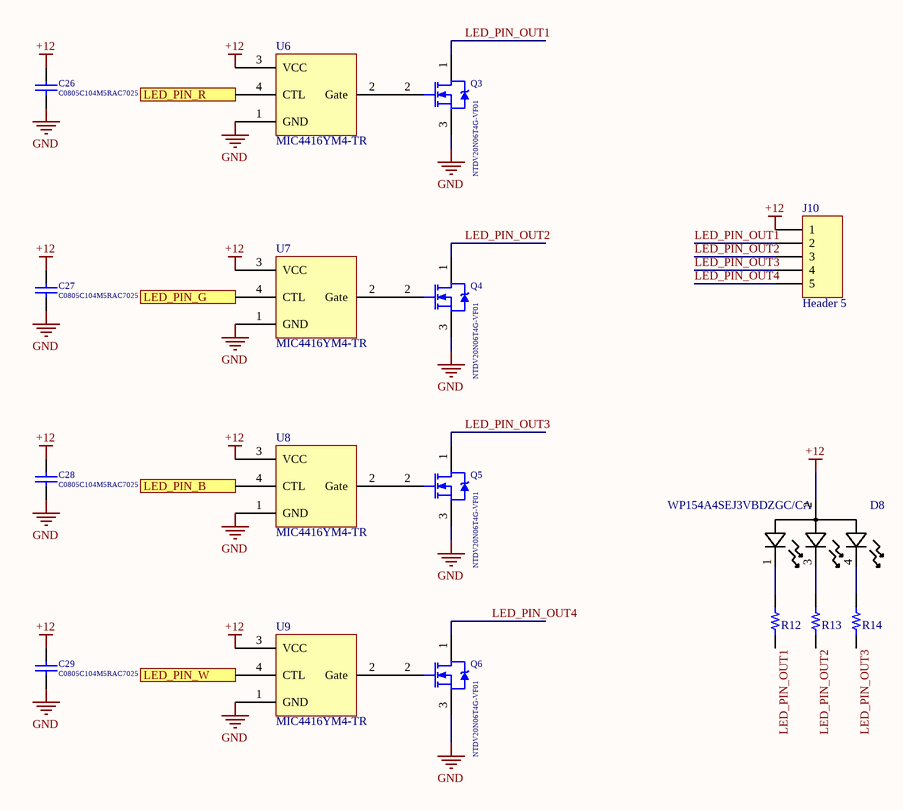
[diagram p6: LED_PORT.SchDoc]

### Parts
C26  C0805C104M5RAC7025  [CAP SMD 0805]
C27  C0805C104M5RAC7025  [CAP SMD 0805]
C28  C0805C104M5RAC7025  [CAP SMD 0805]
C29  C0805C104M5RAC7025  [CAP SMD 0805]
D8  WP154A4SEJ3VBDZGC/CA  [LED_RGB_5MM]
J10  Header 5  [CONN. 5]
Q3  NTDV20N06T4G-VF01  [DPAK228P991X238-3N]
Q4  NTDV20N06T4G-VF01  [DPAK228P991X238-3N]
Q5  NTDV20N06T4G-VF01  [DPAK228P991X238-3N]
Q6  NTDV20N06T4G-VF01  [DPAK228P991X238-3N]
R12  1k  [RES SMD 0805]  (value not drawn)
R13  1K  [RES SMD 0805]  (value not drawn)
R14  1K  [RES SMD 0805]  (value not drawn)
U6  MIC4416YM4-TR  [MICROCHIP SOT-143-4]
U7  MIC4416YM4-TR  [MICROCHIP SOT-143-4]
U8  MIC4416YM4-TR  [MICROCHIP SOT-143-4]
U9  MIC4416YM4-TR  [MICROCHIP SOT-143-4]

### Ports
LED_PIN_B (in), LED_PIN_G (in), LED_PIN_R (in), LED_PIN_W (in)

### Nets
+12: C26.2 C27.2 C28.2 C29.2 D8.2 J10.1 U6.3(VCC) U7.3(VCC) U8.3(VCC) U9.3(VCC)
GND: C26.1 C27.1 C28.1 C29.1 Q3.3(S) Q4.3(S) Q5.3(S) Q6.3(S) U6.1(GND) U7.1(GND) U8.1(GND) U9.1(GND)
LED_PIN_B: U8.4(CTL) ; port LED_PIN_B
LED_PIN_G: U7.4(CTL) ; port LED_PIN_G
LED_PIN_OUT1: J10.2 Q3.1(D) R12.1
LED_PIN_OUT2: J10.3 Q4.1(D) R13.1
LED_PIN_OUT3: J10.4 Q5.1(D) R14.1
LED_PIN_OUT4: J10.5 Q6.1(D)
LED_PIN_R: U6.4(CTL) ; port LED_PIN_R
LED_PIN_W: U9.4(CTL) ; port LED_PIN_W
NetD8_1: D8.1 R12.2
NetD8_3: D8.3 R13.2
NetD8_4: D8.4 R14.2
NetQ3_2: Q3.2(G) U6.2(Gate)
NetQ4_2: Q4.2(G) U7.2(Gate)
NetQ5_2: Q5.2(G) U8.2(Gate)
NetQ6_2: Q6.2(G) U9.2(Gate)

### Channels
U__LED_PORT01: designators end in _U__LED_PORT01; ports LED_PIN_B=LED_PIN_B1 LED_PIN_G=LED_PIN_G1 LED_PIN_R=LED_PIN_R1 LED_PIN_W=LED_PIN_W1
U__LED_PORT2: designators end in _U__LED_PORT2; ports LED_PIN_B=LED_PIN_B2 LED_PIN_G=LED_PIN_G2 LED_PIN_R=LED_PIN_R2 LED_PIN_W=LED_PIN_W2
U__LED_PORT3: designators end in _U__LED_PORT3; ports LED_PIN_B=LED_PIN_B3 LED_PIN_G=LED_PIN_G3 LED_PIN_R=LED_PIN_R3 LED_PIN_W=LED_PIN_W3
U__LED_PORT4: designators end in _U__LED_PORT4; ports LED_PIN_B=LED_PIN_B4 LED_PIN_G=LED_PIN_G4 LED_PIN_R=LED_PIN_R4 LED_PIN_W=LED_PIN_W4
U__LED_PORT5: designators end in _U__LED_PORT5; ports LED_PIN_B=LED_PIN_B5 LED_PIN_G=LED_PIN_G5 LED_PIN_R=LED_PIN_R5 LED_PIN_W=LED_PIN_W5
U__LED_PORT6: designators end in _U__LED_PORT6; ports LED_PIN_B=LED_PIN_B6 LED_PIN_G=LED_PIN_G6 LED_PIN_R=LED_PIN_R6 LED_PIN_W=LED_PIN_W6
U__LED_PORT7: designators end in _U__LED_PORT7; ports LED_PIN_B=LED_PIN_B7 LED_PIN_G=LED_PIN_G7 LED_PIN_R=LED_PIN_R7 LED_PIN_W=LED_PIN_W7
U__LED_PORT8: designators end in _U__LED_PORT8; ports LED_PIN_B=LED_PIN_B8 LED_PIN_G=LED_PIN_G8 LED_PIN_R=LED_PIN_R8 LED_PIN_W=LED_PIN_W8
U__LED_PORT9: designators end in _U__LED_PORT9; ports LED_PIN_B=LED_PIN_B9 LED_PIN_G=LED_PIN_G9 LED_PIN_R=LED_PIN_R9 LED_PIN_W=LED_PIN_W9
U__LED_PORT10: designators end in _U__LED_PORT10; ports LED_PIN_B=LED_PIN_B10 LED_PIN_G=LED_PIN_G10 LED_PIN_R=LED_PIN_R10 LED_PIN_W=LED_PIN_W10

### Library data of the parts
C26-C29 = Cap_3_1: 0.1 µF ±20% 50V Ceramic Capacitor X7R 0805 (2012 Metric); Value: 0.1uF; Published: 8-Jun-2000; LatestRevisionDate: 17-Jul-2002; LatestRevisionNote: Re-released for DXP Platform.; PackageReference: RAD-0.3; Publisher: Altium Limited; PackageDescription: Radial Cap, Thru-Hole; 2 Leads; 0.3 in Pin Spacing
D8 = WP154A4SEJ3VBDZGC/CA: 5mm RGB Tri-Color Round Lamp; Mfr_Name: Kingbright; Type: DEV; Copyright: Copyright (C) 2022 Ultra Librarian. All rights reserved.; Manufacturer_Part_Number: WP154A4SEJ3VBDZGC/CA; Digi-Key_Part_Number_1: 754-2153-ND; Digi-Key_Part_Number_2: 754-2153-NDL; RefDes: RefDes
J10 = TermBlock 5: 5 Position Terminal Block Header, Male Pins, Shrouded (2 Side) 0.197" (5.00mm) 90°, Right Angle - Through Hole; LatestRevisionDate: 17-Jul-2002; LatestRevisionNote: Re-released for DXP Platform.; Publisher: Altium Limited
Q3-Q6 = IRF540NS: MOSFET N-CH 60V 20A DPAK; Manufacture: ON Semiconductor; Manufacture Part Number: IRF540N_R4942; Published: 8-Jun-2000; LatestRevisionDate: 20-Nov-2009; LatestRevisionNote: IPC-7351 Footprint Added.; DatasheetVersion: May-1998; PackageReference: TO-220AB; Publisher: Altium Limited; PackageDescription: TO, Thru-Hole, Vertical, Heatsink Mounted; 3 In-Line Leads; Pitch 2.54 mm; ComponentLink1Description: Manufacturer Link; ComponentLink1URL: http://www.irf.com/; ComponentLink2Description: Datasheet; ComponentLink2URL: http://www.irf.com/product-info/datasheets/data/irf540ns.pdf; Supplier: Local; Supplier Part Number: IRF540N
R12 = RESISTOR: RES SMD 1k OHM 1% 1/4W 0805
R13 R14 = RESISTOR_2: RES SMD 1K OHM 1% 1/4W 0805
U6-U9 = MIC4416YM4-TR: IC GATE DRVR LOW-SIDE SOT143; Manufacturer: Microchip Technology; Channel Type: Single; Current - Peak Output (Source, Sink): 1.2A, 1.2A; Gate Type: N-Channel MOSFET; Input Type: Non-Inverting; Logic Voltage - VIL, VIH: 0.8V, 2.4V; Number of Drivers: 1; Rise / Fall Time (Typ): 14ns, 16ns; Voltage - Supply: 4.5V ~ 18V; Part Number: MIC4416YM4-TR; ComponentLink1Description: Datasheet; ComponentLink1URL: http://www.microchip.com/mymicrochip/filehandler.aspx?ddocname=en579163; ComponentLink2Description: DigiKey Link; ComponentLink2URL: http://digikey.com/product-detail/en/microchip-technology/MIC4416YM4-TR/576-1187-1-ND/771864; Device Package: TO-253-4, TO-253AA; Driven Configuration: Low-Side; LastUpdated: 31/01/2020 01:32:45; Lifecycle Status: Active; Minimum Order: 1; Mounting Type: Surface Mount; Operating Temperature: -40°C ~ 150°C (TJ); Package / Case: TO-253-4, TO-253AA; Packaging: TapeAndReel; PartId: 7; Part Status: Active; Price: 0.68; Series: IttyBitty®; Supplier 1: DigiKey; Supplier Part Number 1: 576-1187-1-ND; Supplier Device Package: SOT-143

## Nets that join several sheets
+12: Rs232 (D1.2 J3.4), U__LED_PORT01 (10 pins), U__LED_PORT2 (10 pins), U__LED_PORT3 (10 pins), U__LED_PORT4 (10 pins), U__LED_PORT5 (10 pins), U__LED_PORT6 (10 pins), U__LED_PORT7 (10 pins), U__LED_PORT8 (10 pins), U__LED_PORT9 (10 pins), U__LED_PORT10 (10 pins)
GND: DIY-USB Led Controller (S1.1A S1.2A S1.3A S1.4A), EEPROM (6 pins), Rs232 (13 pins), USB_CH340G (10 pins), microcontroller (17 pins), U__LED_PORT01 (12 pins), U__LED_PORT2 (12 pins), U__LED_PORT3 (12 pins), U__LED_PORT4 (12 pins), U__LED_PORT5 (12 pins), U__LED_PORT6 (12 pins), U__LED_PORT7 (12 pins), U__LED_PORT8 (12 pins), U__LED_PORT9 (12 pins), U__LED_PORT10 (12 pins)
VCC: EEPROM (C21.2 R6.2 R7.2 U4.8), Rs232 (7 pins), USB_CH340G (D7.1 J8.3 Q1.2 Q2.2), microcontroller (14 pins)
232RX: Rs232 (J4.1 U2.9), microcontroller (U3.3)
232TX: Rs232 (J2.1 U2.10), microcontroller (U3.2)
DTR: USB_CH340G (u5.13), microcontroller (C11.1)
EE_SCL: EEPROM (J7.1 R7.1 U4.6), microcontroller (U3.11)
EE_SDA: EEPROM (J6.1 R6.1 U4.5), microcontroller (U3.10)
LED_PIN_B1: microcontroller (U3.13), U__LED_PORT01 (U8_U__LED_PORT01.4)
LED_PIN_B2: microcontroller (U3.17), U__LED_PORT2 (U8_U__LED_PORT2.4)
LED_PIN_B3: microcontroller (U3.23), U__LED_PORT3 (U8_U__LED_PORT3.4)
LED_PIN_B4: microcontroller (U3.27), U__LED_PORT4 (U8_U__LED_PORT4.4)
LED_PIN_B5: microcontroller (U3.31), U__LED_PORT5 (U8_U__LED_PORT5.4)
LED_PIN_B6: microcontroller (U3.37), U__LED_PORT6 (U8_U__LED_PORT6.4)
LED_PIN_B7: microcontroller (U3.41), U__LED_PORT7 (U8_U__LED_PORT7.4)
LED_PIN_B8: microcontroller (U3.45), U__LED_PORT8 (U8_U__LED_PORT8.4)
LED_PIN_B9: microcontroller (U3.53), U__LED_PORT9 (U8_U__LED_PORT9.4)
LED_PIN_B10: microcontroller (U3.59), U__LED_PORT10 (U8_U__LED_PORT10.4)
LED_PIN_G1: microcontroller (U3.14), U__LED_PORT01 (U7_U__LED_PORT01.4)
LED_PIN_G2: microcontroller (U3.18), U__LED_PORT2 (U7_U__LED_PORT2.4)
LED_PIN_G3: microcontroller (U3.24), U__LED_PORT3 (U7_U__LED_PORT3.4)
LED_PIN_G4: microcontroller (U3.28), U__LED_PORT4 (U7_U__LED_PORT4.4)
LED_PIN_G5: microcontroller (U3.32), U__LED_PORT5 (U7_U__LED_PORT5.4)
LED_PIN_G6: microcontroller (U3.38), U__LED_PORT6 (U7_U__LED_PORT6.4)
LED_PIN_G7: microcontroller (U3.42), U__LED_PORT7 (U7_U__LED_PORT7.4)
LED_PIN_G8: microcontroller (U3.46), U__LED_PORT8 (U7_U__LED_PORT8.4)
LED_PIN_G9: microcontroller (U3.54), U__LED_PORT9 (U7_U__LED_PORT9.4)
LED_PIN_G10: microcontroller (U3.60), U__LED_PORT10 (U7_U__LED_PORT10.4)
LED_PIN_R1: microcontroller (U3.15), U__LED_PORT01 (U6_U__LED_PORT01.4)
LED_PIN_R2: microcontroller (U3.19), U__LED_PORT2 (U6_U__LED_PORT2.4)
LED_PIN_R3: microcontroller (U3.25), U__LED_PORT3 (U6_U__LED_PORT3.4)
LED_PIN_R4: microcontroller (U3.29), U__LED_PORT4 (U6_U__LED_PORT4.4)
LED_PIN_R5: microcontroller (U3.33), U__LED_PORT5 (U6_U__LED_PORT5.4)
LED_PIN_R6: microcontroller (U3.39), U__LED_PORT6 (U6_U__LED_PORT6.4)
LED_PIN_R7: microcontroller (U3.43), U__LED_PORT7 (U6_U__LED_PORT7.4)
LED_PIN_R8: microcontroller (U3.47), U__LED_PORT8 (U6_U__LED_PORT8.4)
LED_PIN_R9: microcontroller (U3.55), U__LED_PORT9 (U6_U__LED_PORT9.4)
LED_PIN_R10: microcontroller (U3.61), U__LED_PORT10 (U6_U__LED_PORT10.4)
LED_PIN_W1: microcontroller (U3.12), U__LED_PORT01 (U9_U__LED_PORT01.4)
LED_PIN_W2: microcontroller (U3.16), U__LED_PORT2 (U9_U__LED_PORT2.4)
LED_PIN_W3: microcontroller (U3.22), U__LED_PORT3 (U9_U__LED_PORT3.4)
LED_PIN_W4: microcontroller (U3.26), U__LED_PORT4 (U9_U__LED_PORT4.4)
LED_PIN_W5: microcontroller (U3.30), U__LED_PORT5 (U9_U__LED_PORT5.4)
LED_PIN_W6: microcontroller (U3.36), U__LED_PORT6 (U9_U__LED_PORT6.4)
LED_PIN_W7: microcontroller (U3.40), U__LED_PORT7 (U9_U__LED_PORT7.4)
LED_PIN_W8: microcontroller (U3.44), U__LED_PORT8 (U9_U__LED_PORT8.4)
LED_PIN_W9: microcontroller (U3.52), U__LED_PORT9 (U9_U__LED_PORT9.4)
LED_PIN_W10: microcontroller (U3.58), U__LED_PORT10 (U9_U__LED_PORT10.4)
NetJ1_1: DIY-USB Led Controller (J1.1 S1.1B), microcontroller (U3.62)
NetS1_2B: DIY-USB Led Controller (S1.2B), microcontroller (U3.63)
NetS1_3B: DIY-USB Led Controller (S1.3B), microcontroller (U3.64)
NetS1_4B: DIY-USB Led Controller (S1.4B), microcontroller (U3.1)
RXD: USB_CH340G (J8.2 R9.1 u5.3), microcontroller (U3.8)
RXD3: USB_CH340G (J8.1 R8.1 u5.2), microcontroller (U3.9)